# EAGLE design comcon_version_thruhole (EAGLE 7.2.0)
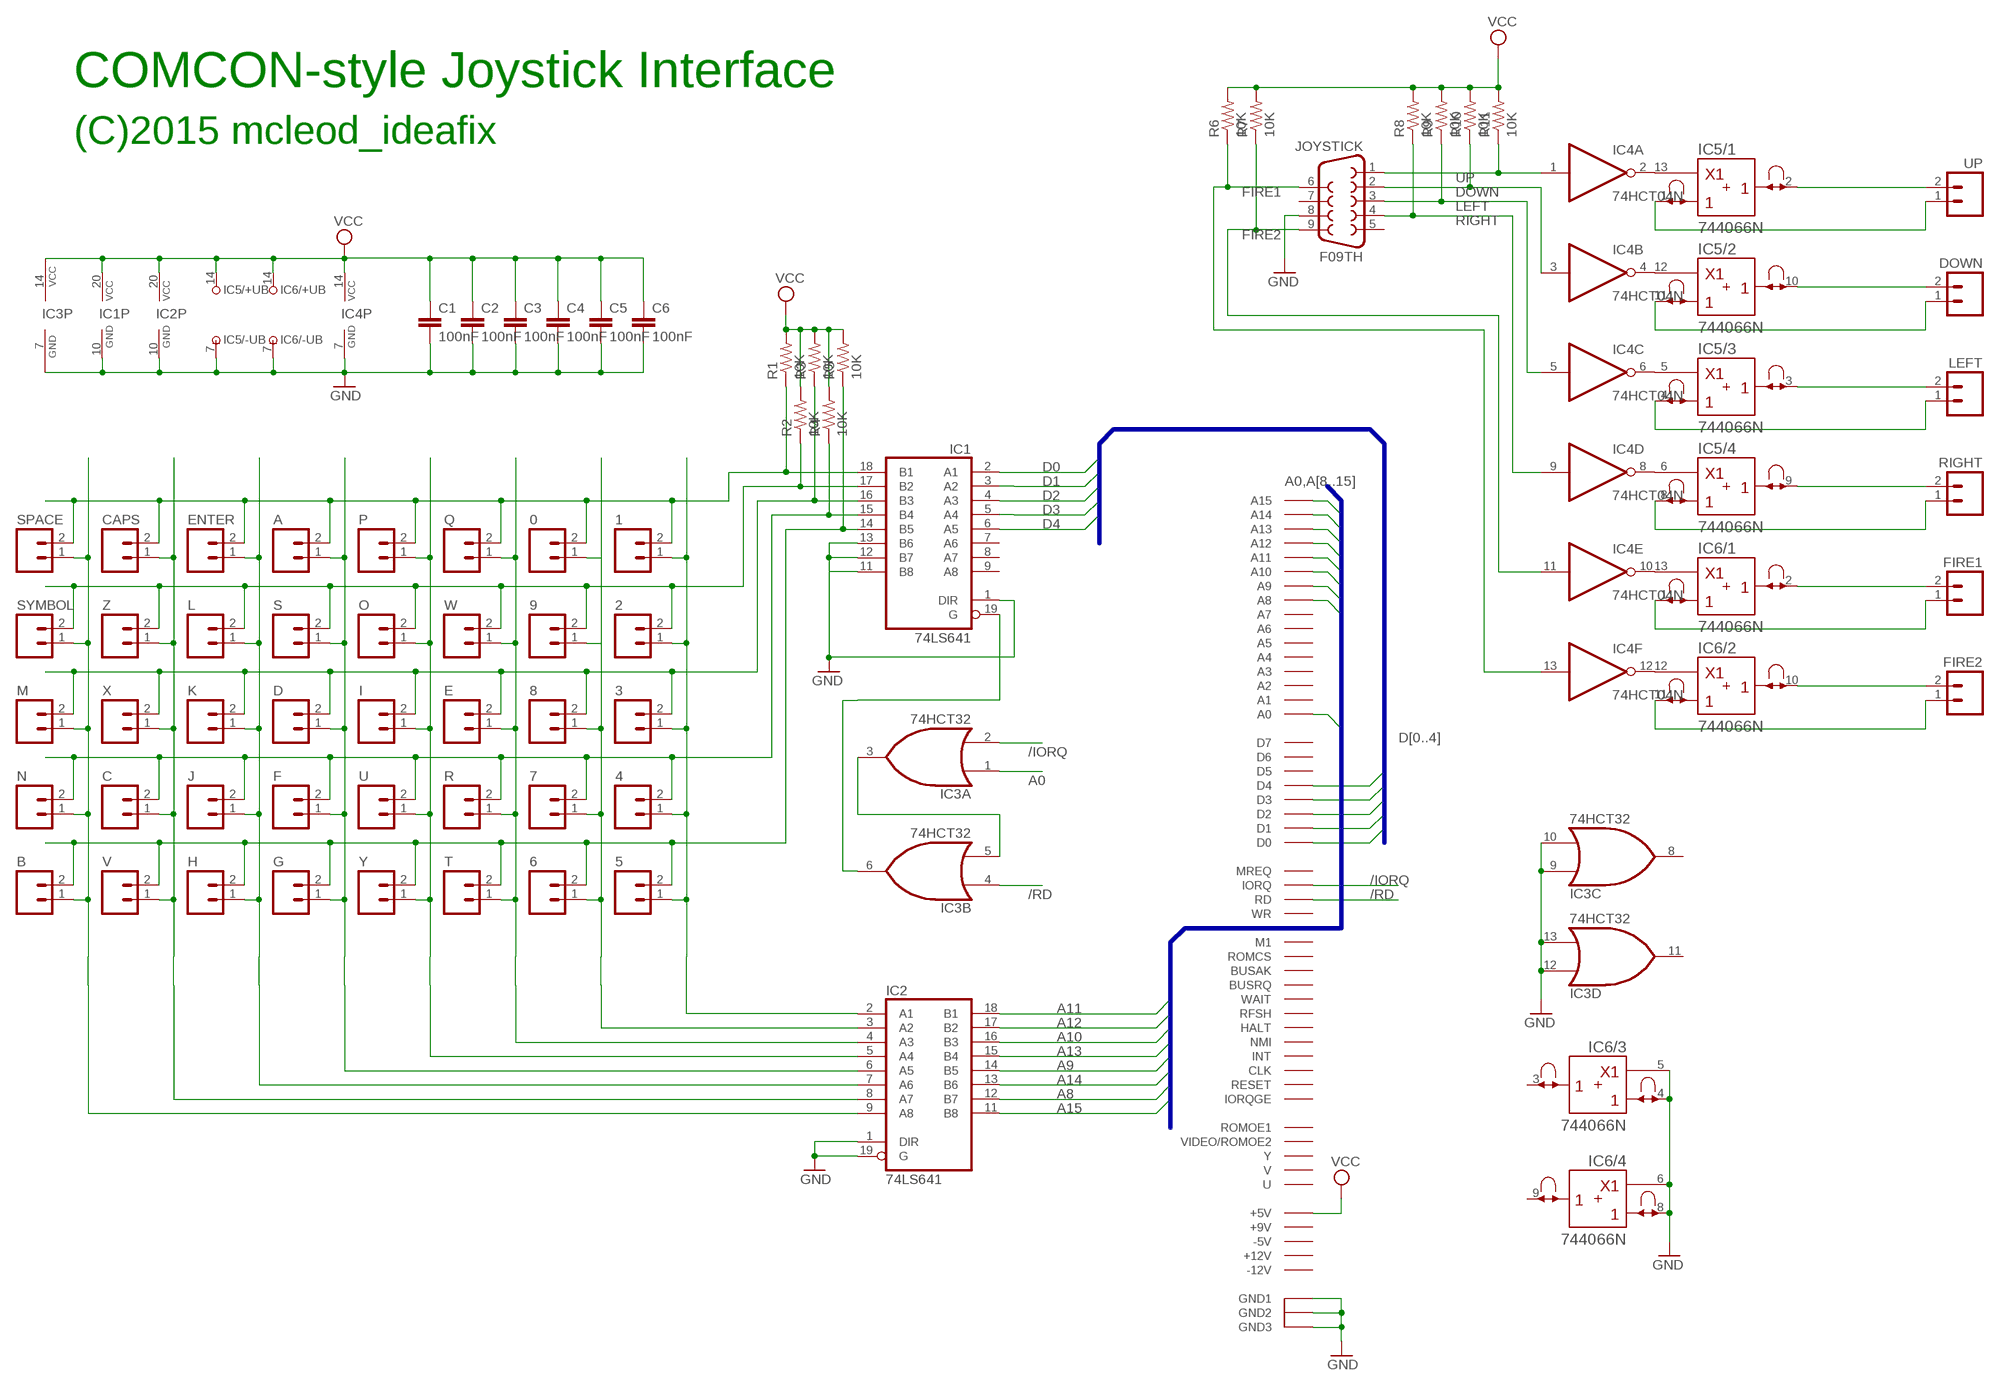
[diagram p0: schematic, sheet 1]

## Parts
0  M02PTH  [1X02]
1  M02PTH  [1X02]
2  M02PTH  [1X02]
3  M02PTH  [1X02]
4  M02PTH  [1X02]
5  M02PTH  [1X02]
6  M02PTH  [1X02]
7  M02PTH  [1X02]
8  M02PTH  [1X02]
9  M02PTH  [1X02]
A  M02PTH  [1X02]
B  M02PTH  [1X02]
C  M02PTH  [1X02]
C1  100nF  C-EU050-025X075  [C050-025X075]
C2  100nF  C-EU050-025X075  [C050-025X075]
C3  100nF  C-EU050-025X075  [C050-025X075]
C4  100nF  C-EU050-025X075  [C050-025X075]
C5  100nF  C-EU050-025X075  [C050-025X075]
C6  100nF  C-EU050-025X075  [C050-025X075]
CAPS  M02PTH  [1X02]
D  M02PTH  [1X02]
DOWN  M02PTH  [1X02]
E  M02PTH  [1X02]
ENTER  M02PTH  [1X02]
F  M02PTH  [1X02]
FIRE1  M02PTH  [1X02]
FIRE2  M02PTH  [1X02]
G  M02PTH  [1X02]
H  M02PTH  [1X02]
I  M02PTH  [1X02]
IC1  74LS641  74HCT245N  [DIL20]
IC2  74LS641  74HCT245N  [DIL20]
IC3  74HCT32  74LS32N  [DIL14]
IC4  74HCT04N  [DIL14]
IC5  744066N  [DIL14]
IC6  744066N  [DIL14]
J  M02PTH  [1X02]
JOYSTICK  F09TH  [DB9_PCB]
K  M02PTH  [1X02]
L  M02PTH  [1X02]
LEFT  M02PTH  [1X02]
M  M02PTH  [1X02]
N  M02PTH  [1X02]
O  M02PTH  [1X02]
P  M02PTH  [1X02]
Q  M02PTH  [1X02]
R  M02PTH  [1X02]
R1  10K  R-US_0207/10  [0207/10]
R2  10K  R-US_0207/10  [0207/10]
R3  10K  R-US_0207/10  [0207/10]
R4  10K  R-US_0207/10  [0207/10]
R5  10K  R-US_0207/10  [0207/10]
R6  10K  R-US_0207/10  [0207/10]
R7  10K  R-US_0207/10  [0207/10]
R8  10K  R-US_0207/10  [0207/10]
R9  10K  R-US_0207/10  [0207/10]
R10  10K  R-US_0207/10  [0207/10]
R11  10K  R-US_0207/10  [0207/10]
RIGHT  M02PTH  [1X02]
S  M02PTH  [1X02]
SPACE  M02PTH  [1X02]
SYMBOL  M02PTH  [1X02]
T  M02PTH  [1X02]
U  M02PTH  [1X02]
UP  M02PTH  [1X02]
V  M02PTH  [1X02]
W  M02PTH  [1X02]
X  M02PTH  [1X02]
Y  M02PTH  [1X02]
Z  M02PTH  [1X02]
ZX_BUS  CONECTOR_SPECTRUM  [CONECTOR_SPECTRUM]

## Nets
/IORQ: IC3.2(A:I1) ZX_BUS.IORQ
/RD: IC3.4(B:I0) ZX_BUS.RD
A0: IC3.1(A:I0) ZX_BUS.A0
A8: IC2.12(B7) ZX_BUS.A8
A9: IC2.14(B5) ZX_BUS.A9
A10: IC2.16(B3) ZX_BUS.A10
A11: IC2.18(B1) ZX_BUS.A11
A12: IC2.17(B2) ZX_BUS.A12
A13: IC2.15(B4) ZX_BUS.A13
A14: IC2.13(B6) ZX_BUS.A14
A15: IC2.11(B8) ZX_BUS.A15
D0: IC1.2(A1) ZX_BUS.D0
D1: IC1.3(A2) ZX_BUS.D1
D2: IC1.4(A3) ZX_BUS.D2
D3: IC1.5(A4) ZX_BUS.D3
D4: IC1.6(A5) ZX_BUS.D4
DOWN: IC4.3(B:I) JOYSTICK.2 R10.1
FIRE1: IC4.13(F:I) JOYSTICK.6 R6.1
FIRE2: IC4.11(E:I) JOYSTICK.9 R7.1
GND [power]: C1.2 C2.2 C3.2 C4.2 C5.2 C6.2 IC1.1(DIR) IC1.10(GND) IC1.11(B8) IC1.12(B7) IC1.13(B6) IC2.1(DIR) IC2.10(GND) IC2.19(G) IC3.7(P:GND) IC3.9(C:I0) IC3.10(C:I1) IC3.12(D:I0) IC3.13(D:I1) IC4.7(P:GND) IC5.7(/-UB:-UB) IC6.4(/3:A) IC6.5(/3:C) IC6.6(/4:C) IC6.7(/-UB:-UB) IC6.8(/4:A) JOYSTICK.8 ZX_BUS.GND1 ZX_BUS.GND2 ZX_BUS.GND3
LEFT: IC4.5(C:I) JOYSTICK.3 R9.1
N$1: IC3.3(A:O) IC3.5(B:I1)
N$2: IC1.19(G) IC3.6(B:O)
N$4: 1.1 2.1 3.1 4.1 5.1 IC2.2(A1)
N$5: 0.1 6.1 7.1 8.1 9.1 IC2.3(A2)
N$6: E.1 IC2.4(A3) Q.1 R.1 T.1 W.1
N$7: I.1 IC2.5(A4) O.1 P.1 U.1 Y.1
N$8: A.1 D.1 F.1 G.1 IC2.6(A5) S.1
N$9: ENTER.1 H.1 IC2.7(A6) J.1 K.1 L.1
N$10: C.1 CAPS.1 IC2.8(A7) V.1 X.1 Z.1
N$11: B.1 IC2.9(A8) M.1 N.1 SPACE.1 SYMBOL.1
N$13: 0.2 1.2 A.2 CAPS.2 ENTER.2 IC1.18(B1) P.2 Q.2 R1.1 SPACE.2
N$14: 2.2 9.2 IC1.17(B2) L.2 O.2 R2.1 S.2 SYMBOL.2 W.2 Z.2
N$15: 3.2 8.2 D.2 E.2 I.2 IC1.16(B3) K.2 M.2 R3.1 X.2
N$16: 4.2 7.2 C.2 F.2 IC1.15(B4) J.2 N.2 R4.1 R.2 U.2
N$17: 5.2 6.2 B.2 G.2 H.2 IC1.14(B5) R5.1 T.2 V.2 Y.2
N$29: DOWN.1 IC5.11(/2:A)
N$30: IC5.4(/3:A) LEFT.1
N$31: IC5.8(/4:A) RIGHT.1
N$32: FIRE1.1 IC6.1(/1:A)
N$33: IC4.2(A:O) IC5.13(/1:C)
N$34: IC4.4(B:O) IC5.12(/2:C)
N$35: IC4.6(C:O) IC5.5(/3:C)
N$36: IC4.8(D:O) IC5.6(/4:C)
N$37: IC4.10(E:O) IC6.13(/1:C)
N$38: IC4.12(F:O) IC6.12(/2:C)
N$39: IC5.1(/1:A) UP.1
N$40: FIRE2.1 IC6.11(/2:A)
N$41: IC5.2(/1:B) UP.2
N$42: DOWN.2 IC5.10(/2:B)
N$43: IC5.3(/3:B) LEFT.2
N$44: IC5.9(/4:B) RIGHT.2
N$45: FIRE1.2 IC6.2(/1:B)
N$46: FIRE2.2 IC6.10(/2:B)
RIGHT: IC4.9(D:I) JOYSTICK.4 R8.1
UP: IC4.1(A:I) JOYSTICK.1 R11.1
VCC [power]: C1.1 C2.1 C3.1 C4.1 C5.1 C6.1 IC1.20(VCC) IC2.20(VCC) IC3.14(P:VCC) IC4.14(P:VCC) IC5.14(/+UB:+UB) IC6.14(/+UB:+UB) R1.2 R2.2 R3.2 R4.2 R5.2 R6.2 R7.2 R8.2 R9.2 R10.2 R11.2 ZX_BUS.+5V
Unconnected: IC1.7(A6) IC1.8(A7) IC1.9(A8) IC3.8(C:O) IC3.11(D:O) IC6.3(/3:B) IC6.9(/4:B) JOYSTICK.5 JOYSTICK.7 ZX_BUS.+9V ZX_BUS.+12V ZX_BUS.-5V ZX_BUS.-12V ZX_BUS.A1 ZX_BUS.A2 ZX_BUS.A3 ZX_BUS.A4 ZX_BUS.A5 ZX_BUS.A6 ZX_BUS.A7 ZX_BUS.BUSAK ZX_BUS.BUSRQ ZX_BUS.CLK ZX_BUS.D5 ZX_BUS.D6 ZX_BUS.D7 ZX_BUS.HALT ZX_BUS.INT ZX_BUS.IORQGE ZX_BUS.M1 ZX_BUS.MERQ(MREQ) ZX_BUS.NC1(ROMOE1) ZX_BUS.NMI ZX_BUS.RESET ZX_BUS.RFSH ZX_BUS.ROMCS ZX_BUS.U ZX_BUS.V ZX_BUS.VIDEO(VIDEO/ROMOE2) ZX_BUS.WAIT ZX_BUS.WR ZX_BUS.Y

## Buses
A0,A[8..15]
D[0..4]

## Notes on the sheet
- COMCON-style Joystick Interface
- (C)2015 mcleod_ideafix

## Library data of the parts
0 1-9 A B C CAPS D DOWN E ENTER F FIRE1 FIRE2 G H I J K L LEFT M N O P Q R RIGHT S SPACE SYMBOL T U UP V W X Y Z = SparkFun:M02: Header 2 Standard 2-pin 0.1" header. Use with straight break away headers (SKU : PRT-00116), right angle break away headers (PRT-00553), swiss pins (PRT-00743), machine pins (PRT-00117), and female headers (PRT-00115). Molex polarized connector foot print use with SKU : PRT-08233 with associated crimp pins and housings.
C1-C6 = rcl:C-EU: CAPACITOR, European symbol
IC1 IC2 = 74xx-eu:74*245: Octal BUS TRANSCEIVER, 3-state
IC3 = 74xx-us:74*32: Quad 2-input OR gate
IC4 = 74xx-eu:74*04: Hex INVERTER
IC5 IC6 = 74ttl-din:74*4066: Quad analog SWITCH
JOYSTICK = con-subd-new:F09: SUB-D
R1-R11 = adafruit:R-US_: RESISTOR, American symbol
ZX_BUS = zx_spectrum:CONECTOR_SPECTRUM

## Net classes
0 default: width 0.254 mm, clearance 0.203 mm
1 power: width 0.508 mm, clearance 0.254 mm to class 0, clearance 0.254 mm

## Board
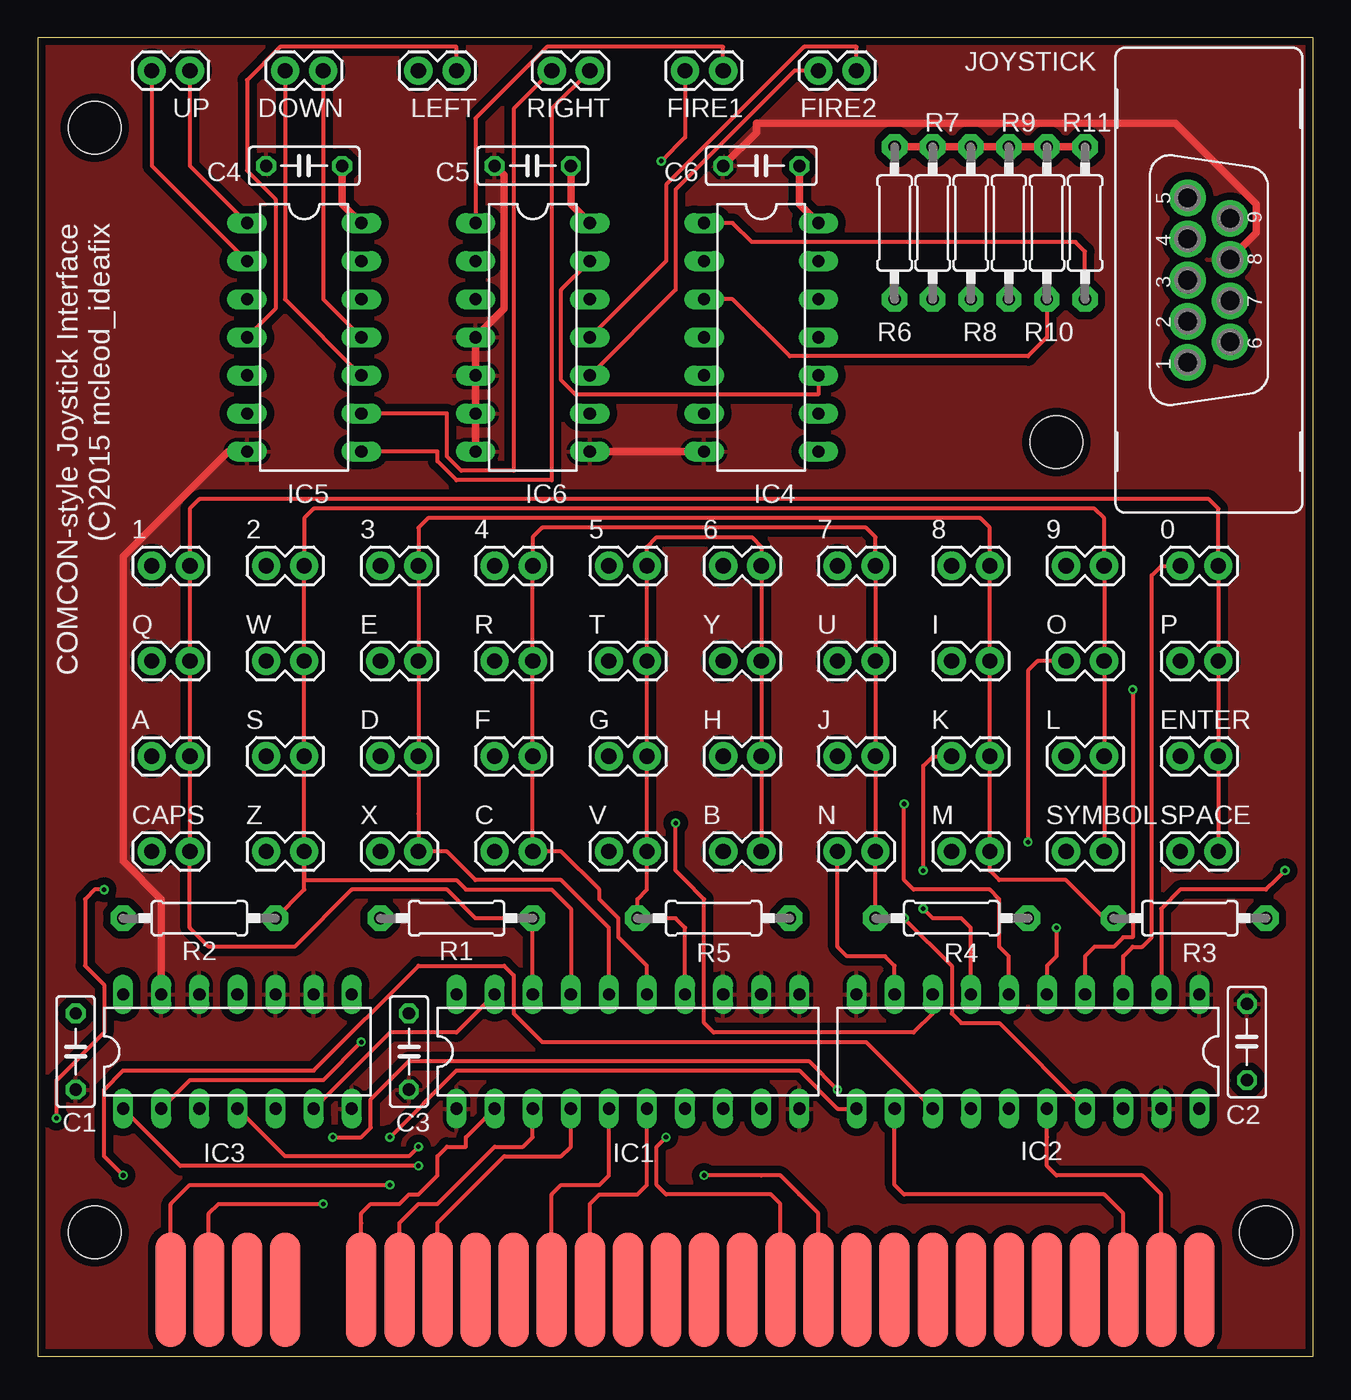
[diagram p1: board, top side]
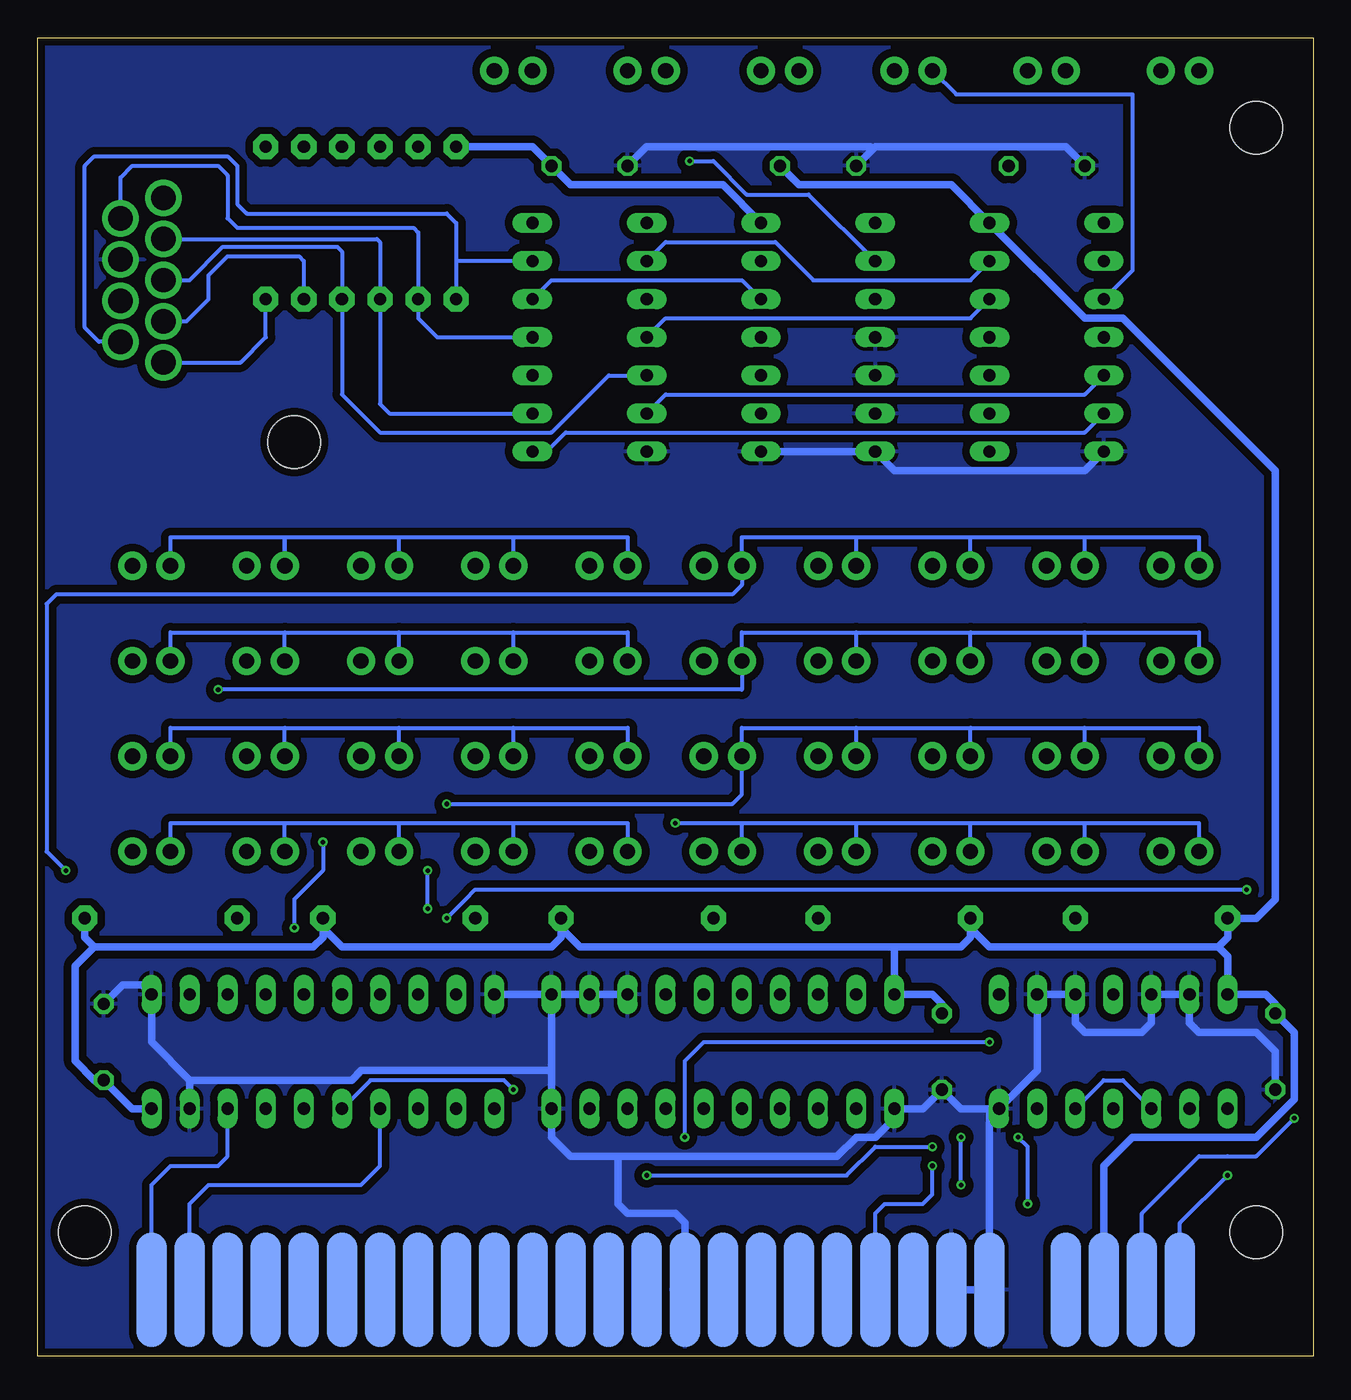
[diagram p2: board, bottom side, seen from below]

Size 85.07 x 87.94 mm. Coordinates in mm from the lower left corner, seen from the top.
Outline: 0,0 85.07,0 85.07,87.94 0,87.94 0,0
Copper layers (1*16): Top 0.035mm / dielectric 1.5mm / Bottom 0.035mm
Design rules "seedstudio_Fusion_eagle_rule_v1.1 *": minimum track width 7mil, minimum drill 12mil, track to track 8mil, track to pad 10mil, pad to pad 6mil, via to via 10mil, smd to smd 0mil, copper to edge 10mil, drill to drill 10mil, minimum pad ring 10mil, minimum via ring 6mil, stop-mask expansion 2mil, vias tented up to drill 100mil, thermal gap 10mil
Holes 3.51 mm at 3.81,8.26 81.92,8.26 3.81,81.92 67.94,60.96

### Footprints (pad centres in the part's own frame; a part is rotated, then mirrored left to right if it is on the bottom)
1X02 = drill 1.016 pad 1.88: 1 0,0; 2 2.54,0
C050-025X075 = drill 0.813 octagon: 1 -2.54,0; 2 2.54,0
DIL20 = drill 0.813 long: 1 -11.43,-3.81; 2 -8.89,-3.81; 3 -6.35,-3.81; 4 -3.81,-3.81; 5 -1.27,-3.81; 6 1.27,-3.81; 7 3.81,-3.81; 8 6.35,-3.81; 9 8.89,-3.81; 10 11.43,-3.81; 11 11.43,3.81; 12 8.89,3.81; 13 6.35,3.81; 14 3.81,3.81; 15 1.27,3.81; 16 -1.27,3.81; 17 -3.81,3.81; 18 -6.35,3.81; 19 -8.89,3.81; 20 -11.43,3.81
DIL14 = drill 0.813 long: 1 -7.62,-3.81; 2 -5.08,-3.81; 3 -2.54,-3.81; 4 0,-3.81; 5 2.54,-3.81; 6 5.08,-3.81; 7 7.62,-3.81; 8 7.62,3.81; 9 5.08,3.81; 10 2.54,3.81; 11 0,3.81; 12 -2.54,3.81; 13 -5.08,3.81; 14 -7.62,3.81
DB9_PCB = drill 1.626 pad 2.032: 1 -5.486,1.422; 2 -2.743,1.422; 3 0,1.422; 4 2.743,1.422; 5 5.486,1.422; 6 -4.115,-1.422; 7 -1.372,-1.422; 8 1.372,-1.422; 9 4.115,-1.422
0207/10 = drill 0.813 pad 1.676 octagon: 1 -5.08,0; 2 5.08,0
CONECTOR_SPECTRUM = smd 7.62 x 2.032 bottom: +5V 0,30.48; +9V 0,27.94; A0 0,15.24; A1 0,12.7; A2 0,10.16; A3 0,7.62; A4 0,-22.86; A5 0,-20.32; A6 0,-17.78; A7 0,-15.24; A9 0,-30.48; A11 0,-33.02; A12 0,33.02; A14 0,35.56; BUSAK 0,-27.94; BUSRQ 0,-10.16; CLK 0,17.78; GND1 0,22.86; GND2 0,20.32; GND3 0,2.54; IORQGE 0,5.08; RESET 0,-12.7; ROMCS 0,-25.4; U 0,-7.62; V 0,-5.08; VIDEO 0,0; Y 0,-2.54 | smd 7.62 x 2.032: +12V 0,-17.78; -5V 0,-12.7; -12V 0,-20.32; A8 0,-27.94; A10 0,-30.48; A13 0,33.02; A15 0,35.56; D0 0,22.86; D1 0,20.32; D2 0,17.78; D3 0,10.16; D4 0,7.62; D5 0,12.7; D6 0,15.24; D7 0,30.48; HALT 0,0; INT 0,5.08; IORQ 0,-5.08; M1 0,-22.86; MERQ 0,-2.54; NC1 0,27.94; NC2 0,-33.02; NMI 0,2.54; RD 0,-7.62; RFSH 0,-25.4; WAIT 0,-15.24; WR 0,-10.16

### Placement (x,y rotation side)
0  76.2,52.7 0 top
1  7.62,52.7 0 top
2  15.24,52.7 0 top
3  22.86,52.7 0 top
4  30.48,52.7 0 top
5  38.1,52.7 0 top
6  45.72,52.7 0 top
7  53.34,52.7 0 top
8  60.96,52.7 0 top
9  68.58,52.7 0 top
A  7.62,40.01 0 top
B  45.72,33.66 0 top
C  30.48,33.66 0 top
C1  2.54,20.32 270 top
C2  80.64,20.95 90 top
C3  24.77,20.32 270 top
C4  17.78,79.38 180 top
C5  33.02,79.38 180 top
C6  48.26,79.38 180 top
CAPS  7.62,33.66 0 top
D  22.86,40.01 0 top
DOWN  19.05,85.72 180 top
E  22.86,46.35 0 top
ENTER  76.2,40.01 0 top
F  30.48,40.01 0 top
FIRE1  45.72,85.72 180 top
FIRE2  54.61,85.72 180 top
G  38.1,40.01 0 top
H  45.72,40.01 0 top
I  60.96,46.35 0 top
IC1  39.37,20.32 0 top
IC2  66.04,20.32 180 top
IC3  13.34,20.32 0 top
IC4  48.26,67.94 270 top
IC5  17.78,67.94 270 top
IC6  33.02,67.94 270 top
J  53.34,40.01 0 top
JOYSTICK  78.11,71.75 90 top
K  60.96,40.01 0 top
L  68.58,40.01 0 top
LEFT  27.94,85.72 180 top
M  60.96,33.66 0 top
N  53.34,33.66 0 top
O  68.58,46.35 0 top
P  76.2,46.35 0 top
Q  7.62,46.35 0 top
R  30.48,46.35 0 top
R1  27.94,29.21 180 top
R2  10.79,29.21 180 top
R3  76.83,29.21 0 top
R4  60.96,29.21 0 top
R5  45.09,29.21 0 top
R6  57.15,75.56 90 top
R7  59.69,75.56 90 top
R8  62.23,75.56 90 top
R9  64.77,75.56 90 top
R10  67.31,75.56 90 top
R11  69.85,75.56 90 top
RIGHT  36.83,85.72 180 top
S  15.24,40.01 0 top
SPACE  76.2,33.66 0 top
SYMBOL  68.58,33.66 0 top
T  38.1,46.35 0 top
U  53.34,46.35 0 top
UP  10.16,85.72 180 top
V  38.1,33.66 0 top
W  15.24,46.35 0 top
X  22.86,33.66 0 top
Y  45.72,46.35 0 top
Z  15.24,33.66 0 top
ZX_BUS  44.45,4.45 90 top

### Tracks (layer width: path | path; a pad name or v marks a point on that pad's centre or on a via)
/IORQ  (via drill 0.3, 0.3 pad 0.61)
  Top 0.254: IC3.2 10.16,18.41 19.05,18.41 v21.59,20.95 | ZX_BUS.IORQ 49.53,6.99 49.53,10.16 48.9,10.79 41.91,10.79 41.27,11.43 41.27,13.97 v41.91,14.61
  Bottom 0.254: v21.59,20.95 40.64,20.95 41.27,20.32 41.91,19.68 v41.91,14.61
/RD  (via drill 0.3)
  Top 0.254: IC3.4 16.51,13.34 24.77,13.34 v25.4,13.97 | v44.45,12.06 48.26,12.06 49.53,12.06 50.8,10.79 52.07,9.53 ZX_BUS.RD
  Bottom 0.254: v25.4,13.97 29.21,13.97 31.11,12.06 v44.45,12.06
A0  (via drill 0.3)
  Top 0.254: IC3.1 9.53,12.7 v25.4,12.7
  Bottom 0.254: v25.4,12.7 25.4,10.79 26.04,10.16 28.57,10.16 29.21,9.53 29.21,6.99 ZX_BUS.A0
A8
  Top 0.254: ZX_BUS.A8 72.39,6.99 72.39,9.53 71.12,10.79 57.78,10.79 57.15,11.43 IC2.12
A9
  Bottom 0.254: ZX_BUS.A9 74.93,6.99 74.93,10.16 73.66,11.43 63.5,11.43 62.23,12.7 IC2.14
A10
  Top 0.254: IC2.16 67.31,14.61 67.31,12.7 67.94,12.06 73.66,12.06 74.93,10.79 74.93,6.99 ZX_BUS.A10
A11
  Bottom 0.254: ZX_BUS.A11 77.47,6.99 77.47,11.43 76.2,12.7 73.03,12.7 72.39,13.34 IC2.18
A12  (via drill 0.3, 0.3 pad 0.61)
  Top 0.254: IC2.17 64.14,22.23 61.59,22.23 60.96,22.86 60.96,26.04 v57.78,29.21 | v1.27,15.88 1.27,18.41 4.45,21.59 4.45,24.77 3.17,26.04 3.17,30.48 3.81,31.11 v4.45,31.11
  Bottom 0.254: v57.78,29.21 56.52,30.48 55.88,31.11 v4.45,31.11 | v1.27,15.88 3.81,13.34 5.71,13.34 7.62,13.34 11.43,9.53 11.43,7.62 ZX_BUS.A12
A13  (via drill 0.3, 0.3 pad 0.61)
  Top 0.254: v53.34,17.78 51.44,19.68 24.77,19.68 22.23,17.14 22.23,15.24 21.59,14.61 v19.68,14.61 | ZX_BUS.A13 11.43,6.99 11.43,9.53 12.06,10.16 v19.05,10.16
  Bottom 0.254: IC2.15 62.87,18.41 53.98,18.41 v53.34,17.78 | v19.05,10.16 19.05,13.97 v19.68,14.61
A14  (via drill 0.3 pad 0.61)
  Top 0.254: IC2.13 55.24,20.95 33.66,20.95 31.75,22.86 31.75,25.4 31.11,26.04 25.4,26.04 18.41,19.05 5.71,19.05 4.45,17.78 4.45,13.34 v5.71,12.06
  Bottom 0.254: ZX_BUS.A14 8.89,8.89 v5.71,12.06
A15  (via drill 0.3)
  Top 0.254: IC2.11 53.34,16.51 50.8,19.05 27.94,19.05 v23.5,14.61 | v23.5,11.43 10.16,11.43 8.89,10.16 ZX_BUS.A15
  Bottom 0.254: v23.5,11.43 v23.5,14.61
D0
  Top 0.254: IC1.2 28.57,14.61 28.57,13.97 27.3,13.97 26.67,13.34 26.67,12.06 26.04,11.43 25.4,10.79 24.77,10.79 24.13,10.16 22.23,10.16 21.59,9.53 21.59,8.89 ZX_BUS.D0
D1
  Top 0.254: ZX_BUS.D1 24.13,7.62 24.13,8.89 24.77,9.53 25.4,10.16 26.67,10.16 30.48,13.97 32.38,13.97 33.02,14.61 IC1.3
D2
  Top 0.254: ZX_BUS.D2 26.67,7.62 26.67,8.89 27.94,10.16 31.11,13.34 34.92,13.34 35.56,13.97 IC1.4
D3
  Top 0.254: IC1.5 38.1,12.06 37.47,11.43 34.92,11.43 34.29,10.79 34.29,6.99 ZX_BUS.D3
D4
  Top 0.254: IC1.6 40.64,11.43 40.01,10.79 37.47,10.79 36.83,10.16 36.83,6.99 ZX_BUS.D4
DOWN
  Top 0.254: R10.1 67.31,67.94 66.04,66.67 50.16,66.67 46.35,70.48 IC4.3
  Bottom 0.254: JOYSTICK.2 75.13,69.01 73.66,70.48 73.66,72.07 72.39,73.34 67.63,73.34 67.31,73.03 R10.1
FIRE1
  Bottom 0.254: JOYSTICK.6 80.97,67.64 81.92,68.58 81.92,79.38 81.28,80.01 72.39,80.01 71.75,79.38 71.75,76.83 71.12,76.2 57.78,76.2 57.15,75.56 57.15,73.03 | 57.15,73.03 R6.1 | IC4.13 57.15,73.03
FIRE2
  Bottom 0.254: JOYSTICK.9 79.53,78.59 78.74,79.38 73.03,79.38 72.39,78.74 72.39,75.88 71.75,75.25 60.01,75.25 59.69,74.93 R7.1 59.69,69.22 58.42,67.94 IC4.11
GND
  Top 0.508: IC4.7 IC6.8 | IC6.7 IC6.6 IC6.5 IC6.4 31.11,69.85 31.11,78.74 C5.2 | C6.2 47.94,81.6 47.94,82.23 75.88,82.23 81.28,76.83 81.28,74.93 79.69,73.34 JOYSTICK.8 | IC3.13 8.26,30.48 5.71,33.02 5.71,53.34 12.7,60.33 IC5.7
  Bottom 0.508: IC5.7 15.24,59.05 27.94,59.05 IC6.7 IC6.8 | C4.2 16.51,80.64 29.21,80.64 29.37,80.49 | C5.2 29.37,80.49 | C6.2 44.45,80.64 29.53,80.64 29.37,80.49 | C1.2 2.54,20.32 3.17,20.95 3.81,21.59 7.62,21.59 8.26,22.23 IC3.13 IC3.12 10.79,22.23 11.43,21.59 15.24,21.59 15.88,22.23 IC3.10 IC3.9 18.41,22.86 18.41,19.05 IC3.7 | IC3.7 21.59,16.51 | 21.59,16.51 23.5,16.51 C3.2 26.04,16.51 IC1.1 27.94,15.88 29.21,14.61 30.48,14.61 31.75,13.34 43.18,13.34 46.35,13.34 | 50.8,19.05 IC1.10 50.8,14.61 49.53,13.34 46.35,13.34 | 50.8,19.05 IC1.11 | IC1.11 IC1.12 IC1.13 | IC1.11 IC2.10 | C2.2 79.38,24.77 78.11,24.77 IC2.1 77.47,20.95 74.93,18.41 | 74.93,18.41 IC2.19 | ZX_BUS.GND2 ZX_BUS.GND1 21.59,16.51 | 21.59,16.51 IC3.7 | 74.93,18.41 64.14,18.41 63.5,19.05 50.8,19.05 | ZX_BUS.GND3 41.91,7.62 41.91,8.89 42.55,9.53 45.72,9.53 46.35,10.16 46.35,13.34
  pour Top (isolate 0.508): 0,0 85.09,0 85.09,88.27 0,88.27
  pour Bottom (isolate 0.508): 0,0 85.09,0 85.09,88.27 0,88.27
LEFT
  Bottom 0.254: JOYSTICK.3 74.93,71.75 72.71,73.98 65.09,73.98 64.77,73.66 R9.1 64.77,64.14 62.23,61.59 50.8,61.59 46.99,65.41 45.09,65.41 IC4.5
N$1
  Bottom 0.254: IC3.3 12.7,18.41 13.97,18.41 IC3.5
N$2
  Top 0.254: IC3.6 23.5,21.59 27.94,21.59 IC1.19
N$4  (via drill 0.3 pad 0.61)
  Top 0.254: v83.19,32.38 82.55,31.75 81.92,31.11 76.2,31.11 74.93,29.84 IC2.2
  Bottom 0.254: 30.48,54.61 38.1,54.61 5.1 38.1,51.44 38.73,50.8 83.82,50.8 84.45,50.16 84.45,33.66 v83.19,32.38 | 30.48,54.61 22.86,54.61 | 22.86,54.61 15.24,54.61 | 15.24,54.61 7.62,54.61 1.1 | 2.1 15.24,54.61 | 3.1 22.86,54.61 | 4.1 30.48,54.61
N$5
  Top 0.254: IC2.3 72.39,26.67 73.03,27.3 73.66,27.3 74.3,27.94 74.3,52.07 74.93,52.7 0.1
  Bottom 0.254: 0.1 76.2,54.61 68.58,54.61 | 68.58,54.61 9.1 68.58,54.61 | 68.58,54.61 60.96,54.61 | 60.96,54.61 53.34,54.61 | 53.34,54.61 45.72,54.61 6.1 | 7.1 53.34,54.61 | 8.1 60.96,54.61
N$6  (via drill 0.3 pad 0.61)
  Top 0.254: v73.03,44.45 73.03,27.94 72.39,27.94 71.75,27.3 70.48,27.3 69.85,26.67 IC2.4
  Bottom 0.254: 30.48,48.26 38.1,48.26 T.1 38.1,44.45 v73.03,44.45 | 30.48,48.26 22.86,48.26 | 22.86,48.26 15.24,48.26 | 15.24,48.26 7.62,48.26 Q.1 | W.1 15.24,48.26 | E.1 22.86,48.26 | R.1 30.48,48.26
N$7  (via drill 0.3 pad 0.61)
  Top 0.254: O.1 66.67,46.35 66.04,45.72 v66.04,34.29 | v67.94,28.57 67.94,26.67 67.31,26.04 IC2.5
  Bottom 0.254: P.1 76.2,48.26 68.58,48.26 | 68.58,48.26 60.96,48.26 | 60.96,48.26 53.34,48.26 | 53.34,48.26 45.72,48.26 Y.1 | U.1 53.34,48.26 | I.1 60.96,48.26 | O.1 68.58,48.26 | v66.04,34.29 66.04,32.38 67.94,30.48 v67.94,28.57
N$8  (via drill 0.3 pad 0.61)
  Top 0.254: IC2.6 64.77,26.67 64.14,27.3 64.14,30.48 63.5,31.11 58.42,31.11 57.78,31.75 v57.78,36.83
  Bottom 0.254: 30.48,41.91 38.1,41.91 G.1 38.1,37.47 38.73,36.83 v57.78,36.83 | 30.48,41.91 22.86,41.91 | 22.86,41.91 15.24,41.91 | 15.24,41.91 7.62,41.91 A.1 | S.1 15.24,41.91 | D.1 22.86,41.91 | F.1 30.48,41.91
N$9  (via drill 0.3 pad 0.61)
  Top 0.254: IC2.7 62.23,28.57 61.59,29.21 59.69,29.21 v59.05,29.84 | v59.05,32.38 59.05,39.37 59.69,40.01 K.1
  Bottom 0.254: ENTER.1 76.2,41.91 68.58,41.91 | 68.58,41.91 60.96,41.91 | 60.96,41.91 53.34,41.91 | 53.34,41.91 45.72,41.91 H.1 | J.1 53.34,41.91 | K.1 60.96,41.91 | L.1 68.58,41.91 | v59.05,29.84 v59.05,32.38
N$10  (via drill 0.3 pad 0.61)
  Top 0.254: IC2.8 59.69,22.86 58.42,21.59 45.09,21.59 44.45,22.23 44.45,30.48 43.18,31.75 42.55,32.38 v42.55,35.56
  Bottom 0.254: V.1 38.1,35.56 | 38.1,35.56 30.48,35.56 | 30.48,35.56 22.86,35.56 | 22.86,35.56 15.24,35.56 | 15.24,35.56 7.62,35.56 CAPS.1 | Z.1 15.24,35.56 | X.1 22.86,35.56 | C.1 30.48,35.56 | v42.55,35.56 38.1,35.56
N$11
  Top 0.254: IC2.9 57.15,26.04 56.52,26.67 53.98,26.67 53.34,27.3 N.1
  Bottom 0.254: SPACE.1 76.2,35.56 68.58,35.56 | 68.58,35.56 60.96,35.56 | 60.96,35.56 53.34,35.56 | 53.34,35.56 45.72,35.56 B.1 | N.1 53.34,35.56 | M.1 60.96,35.56 | SYMBOL.1 68.58,35.56
N$13
  Top 0.254: SPACE.2 ENTER.2 P.2 0.2 78.74,56.52 78.11,57.15 10.79,57.15 10.16,56.52 1.2 Q.2 A.2 CAPS.2 10.16,28.57 11.43,27.3 17.14,27.3 20.95,31.11 27.3,31.11 29.21,29.21 R1.1 IC1.18
N$14
  Top 0.254: Z.2 S.2 W.2 2.2 17.78,55.88 18.41,56.52 70.48,56.52 71.12,55.88 9.2 O.2 L.2 SYMBOL.2 | R2.1 17.78,31.11 17.78,31.75 | 17.78,31.75 Z.2 | Z.2 17.78,31.75 | 17.78,31.75 27.94,31.75 28.57,31.11 34.29,31.11 35.56,29.84 IC1.17
N$15
  Top 0.254: 8.2 I.2 K.2 M.2 63.5,32.38 64.14,31.75 68.58,31.75 71.12,29.21 R3.1 | 8.2 63.5,54.61 | 63.5,54.61 63.5,55.24 62.87,55.88 26.04,55.88 25.4,55.24 3.2 E.2 D.2 25.4,36.2 X.2 27.3,33.66 29.21,31.75 34.92,31.75 38.1,28.57 IC1.16 | 8.2 63.5,54.61
N$16
  Top 0.254: R4.1 N.2 J.2 U.2 7.2 55.88,54.61 55.24,55.24 33.66,55.24 33.02,54.61 4.2 R.2 F.2 C.2 34.92,33.66 37.47,31.11 37.47,30.48 38.73,29.21 38.73,27.94 40.01,26.67 40.64,26.04 IC1.15
N$17
  Top 0.254: B.2 H.2 Y.2 6.2 48.26,53.98 47.62,54.61 41.27,54.61 40.64,53.98 5.2 T.2 G.2 V.2 40.64,31.11 40.01,30.48 R5.1 42.55,29.21 43.18,28.57 IC1.14
N$29
  Top 0.254: IC5.11 19.05,70.48 DOWN.1
N$30
  Top 0.254: IC5.4 15.88,69.85 15.88,77.15 13.97,79.06 13.97,85.09 16.19,87.31 27.94,87.31 LEFT.1
N$31
  Top 0.254: IC5.8 26.67,60.33 26.67,59.69 27.94,58.42 34.29,58.42 34.29,83.19 RIGHT.1
N$32
  Top 0.254: IC6.1 29.21,82.55 33.97,87.31 45.72,87.31 FIRE1.1
N$33
  Bottom 0.254: IC5.13 22.86,71.75 33.34,71.75 35.88,74.3 43.18,74.3 IC4.2
N$34
  Bottom 0.254: IC5.12 22.86,69.22 43.18,69.22 IC4.4
N$35
  Bottom 0.254: IC5.5 15.24,64.14 43.18,64.14 IC4.6
N$36
  Bottom 0.254: IC5.6 15.24,61.59 49.85,61.59 51.12,60.33 IC4.8
N$37
  Top 0.254: IC6.13 34.92,71.12 34.92,65.09 35.88,64.14 52.07,64.14 IC4.10
N$38
  Bottom 0.254: IC6.12 38.1,71.75 50.8,71.75 IC4.12
N$39
  Top 0.254: IC5.1 10.16,79.38 UP.1
N$40
  Top 0.254: IC6.11 41.91,73.03 41.91,78.11 51.12,87.31 54.61,87.31 FIRE2.1
N$41
  Top 0.254: IC5.2 7.62,79.38 UP.2
N$42
  Top 0.254: IC5.10 16.51,70.48 DOWN.2
N$43
  Bottom 0.254: IC5.3 12.06,72.39 12.06,84.14 23.81,84.14 LEFT.2
N$44
  Top 0.254: IC5.9 27.3,62.87 27.3,60.01 28.26,59.05 31.75,59.05 31.75,83.19 RIGHT.2
N$45  (via drill 0.3)
  Top 0.254: v41.59,79.69 43.18,81.28 FIRE1.2
  Bottom 0.254: IC6.2 33.66,77.47 37.78,77.47 40.01,79.69 v41.59,79.69
N$46
  Top 0.254: IC6.10 42.55,71.12 42.55,77.79 50.48,85.72 FIRE2.2
RIGHT
  Bottom 0.254: JOYSTICK.4 62.43,74.5 62.23,74.3 R8.1 62.23,63.5 61.59,62.87 IC4.9
UP
  Top 0.254: R11.1 69.85,73.66 69.22,74.3 47.62,74.3 46.35,75.56 IC4.1
  Bottom 0.254: JOYSTICK.1 71.53,66.27 69.85,67.94 R11.1
VCC
  Top 0.508: IC5.14 20.32,76.83 C4.1 | IC6.14 35.56,76.83 C5.1 | IC4.14 50.8,76.83 C6.1 | R6.2 R7.2 R8.2 R9.2 R10.2 R11.2
  Bottom 0.508: C5.1 34.29,78.11 24.13,78.11 IC5.14 15.24,69.22 12.7,69.22 2.54,59.05 2.54,30.48 3.81,29.21 R2.2 5.71,27.94 6.35,27.3 | R6.2 52.07,80.64 C6.1 49.53,78.11 39.37,78.11 IC6.14 | R3.2 81.92,27.94 81.28,27.3 | 81.28,27.3 66.67,27.3 66.04,27.94 R4.2 66.04,28.57 64.77,27.3 50.8,27.3 50.16,27.94 R5.2 50.16,28.57 48.9,27.3 27.94,27.3 | 27.94,27.3 23.5,27.3 22.86,27.94 R1.2 22.86,28.57 21.59,27.3 6.35,27.3 | 6.35,27.3 5.71,26.67 IC3.14 3.17,24.13 2.54,23.5 C1.1 1.27,21.59 1.27,17.14 3.81,14.61 6.35,14.61 12.06,14.61 13.97,12.7 13.97,6.99 ZX_BUS.+5V | 27.94,27.3 IC1.20 25.4,24.13 24.77,23.5 C3.1 | IC2.20 78.74,16.51 C2.1 81.28,18.41 82.55,19.68 82.55,26.04 81.28,27.3

### Text on the board
tNames: COMCON-style Joystick Interface / (C)2015 mcleod_ideafix